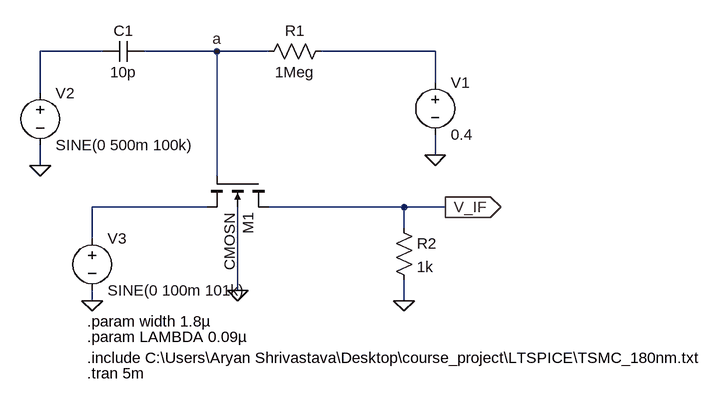
[diagram p0: schematic Mixer_only (1).asc]
Mixer_only (1).asc, the LTspice schematic file:
Version 4
SHEET 1 880 680
WIRE -192 64 -288 64
WIRE -16 64 -128 64
WIRE 64 64 -16 64
WIRE 320 64 144 64
WIRE 320 112 320 64
WIRE -288 128 -288 64
WIRE 320 224 320 192
WIRE -288 240 -288 208
WIRE -16 256 -16 64
WIRE -32 304 -208 304
WIRE 272 304 64 304
WIRE 336 304 272 304
WIRE 272 336 272 304
WIRE -208 352 -208 304
WIRE 16 432 16 304
WIRE -208 448 -208 432
WIRE 272 448 272 416
FLAG 320 224 0
FLAG -288 240 0
FLAG 16 432 0
FLAG -208 448 0
FLAG 272 448 0
FLAG 336 304 V_IF
IOPIN 336 304 Out
FLAG -16 64 a
SYMBOL voltage 320 96 R0
WINDOW 123 0 0 Left 0
WINDOW 39 0 0 Left 0
SYMATTR InstName V1
SYMATTR Value 0.4
SYMBOL res 160 48 R90
WINDOW 0 0 56 VBottom 2
WINDOW 3 32 56 VTop 2
SYMATTR InstName R1
SYMATTR Value 1Meg
SYMBOL cap -128 48 R90
WINDOW 0 0 32 VBottom 2
WINDOW 3 32 32 VTop 2
SYMATTR InstName C1
SYMATTR Value 10p
SYMBOL voltage -288 112 R0
WINDOW 123 0 0 Left 0
WINDOW 39 0 0 Left 0
SYMATTR InstName V2
SYMATTR Value SINE(0 500m 100k)
SYMBOL nmos4 64 256 R90
WINDOW 3 56 60 Left 2
SYMATTR Value CMOSN
SYMATTR InstName M1
SYMATTR Value2 l={2*LAMBDA} w={width} ad={5 * width * LAMBDA} as={5 * width * LAMBDA} pd={10 * LAMBDA + 2* width} ps={10 * LAMBDA + 2* width} m=1
SYMBOL voltage -208 336 R0
WINDOW 123 0 0 Left 0
WINDOW 39 0 0 Left 0
SYMATTR InstName V3
SYMATTR Value SINE(0 100m 101k)
SYMBOL res 256 320 R0
SYMATTR InstName R2
SYMATTR Value 1k
TEXT -216 480 Left 2 !.param width 1.8µ
TEXT -216 504 Left 2 !.param LAMBDA 0.09µ
TEXT -216 536 Left 2 !.include C:\\Users\\Aryan Shrivastava\\Desktop\\course_project\\LTSPICE\\TSMC_180nm.txt
TEXT -216 560 Left 2 !.tran 5m

The netlist it stands for:
* Mixer_only (1).asc
V1 N002 0 0.4
R1 N002 a 1Meg
C1 a N001 10p
V2 N001 0 SINE(0 500m 100k)
M1 V_IF a N003 0 CMOSN l={2*LAMBDA} w={width} ad={5 * width * LAMBDA} as={5 * width * LAMBDA} pd={10 * LAMBDA + 2* width} ps={10 * LAMBDA + 2* width} m=1
V3 N003 0 SINE(0 100m 101k)
R2 V_IF 0 1k
.model NMOS NMOS
.model PMOS PMOS
.lib standard.mos
.param width 1.8µ
.param LAMBDA 0.09µ
.include C:\Users\Aryan Shrivastava\Desktop\course_project\LTSPICE\TSMC_180nm.txt
.tran 5m
.backanno
.end

* Results of the author's LTspice run, read from the files saved beside the schematic
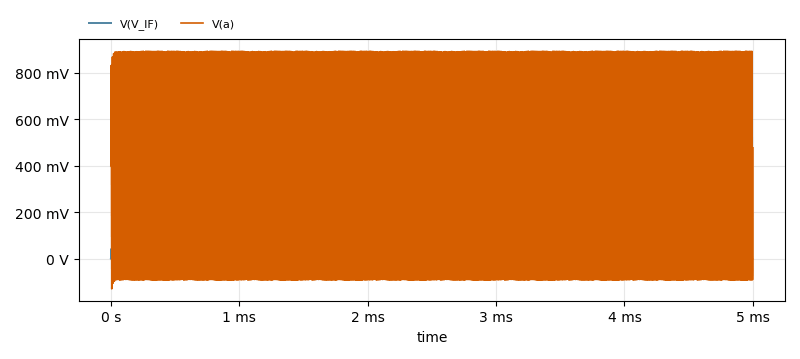
[diagram p1: Transient Analysis of Mixer_only (1).asc, plotted from the saved traces]
* Transient Analysis, 1 run:
*   V(V_IF): min -58.76 mV, max 46.91 mV, average -2.126 mV, rms 19.75 mV, last -51.6 µV
*   V(a): min -129.9 mV, max 892.7 mV, average 399.8 mV, rms 529.6 mV, last 476.9 mV